# Altium schematic sheet discharge-tsmp.SchDoc: discharge-tsmp-board
size A4; Date: 05.10.2017; CheckedBy: UNCHECKED; Author: Leon Loeser; Organization: Baltic Racing; Address1: Zur Schwedenschanze 15; Address2: Haus 18; Address3: 18435 Stralsund; Revision: 1.0; SheetNumber: 1; SheetTotal: 1; Rules: EV 4.9, EV 4.7.6; ProjectName: Projekt
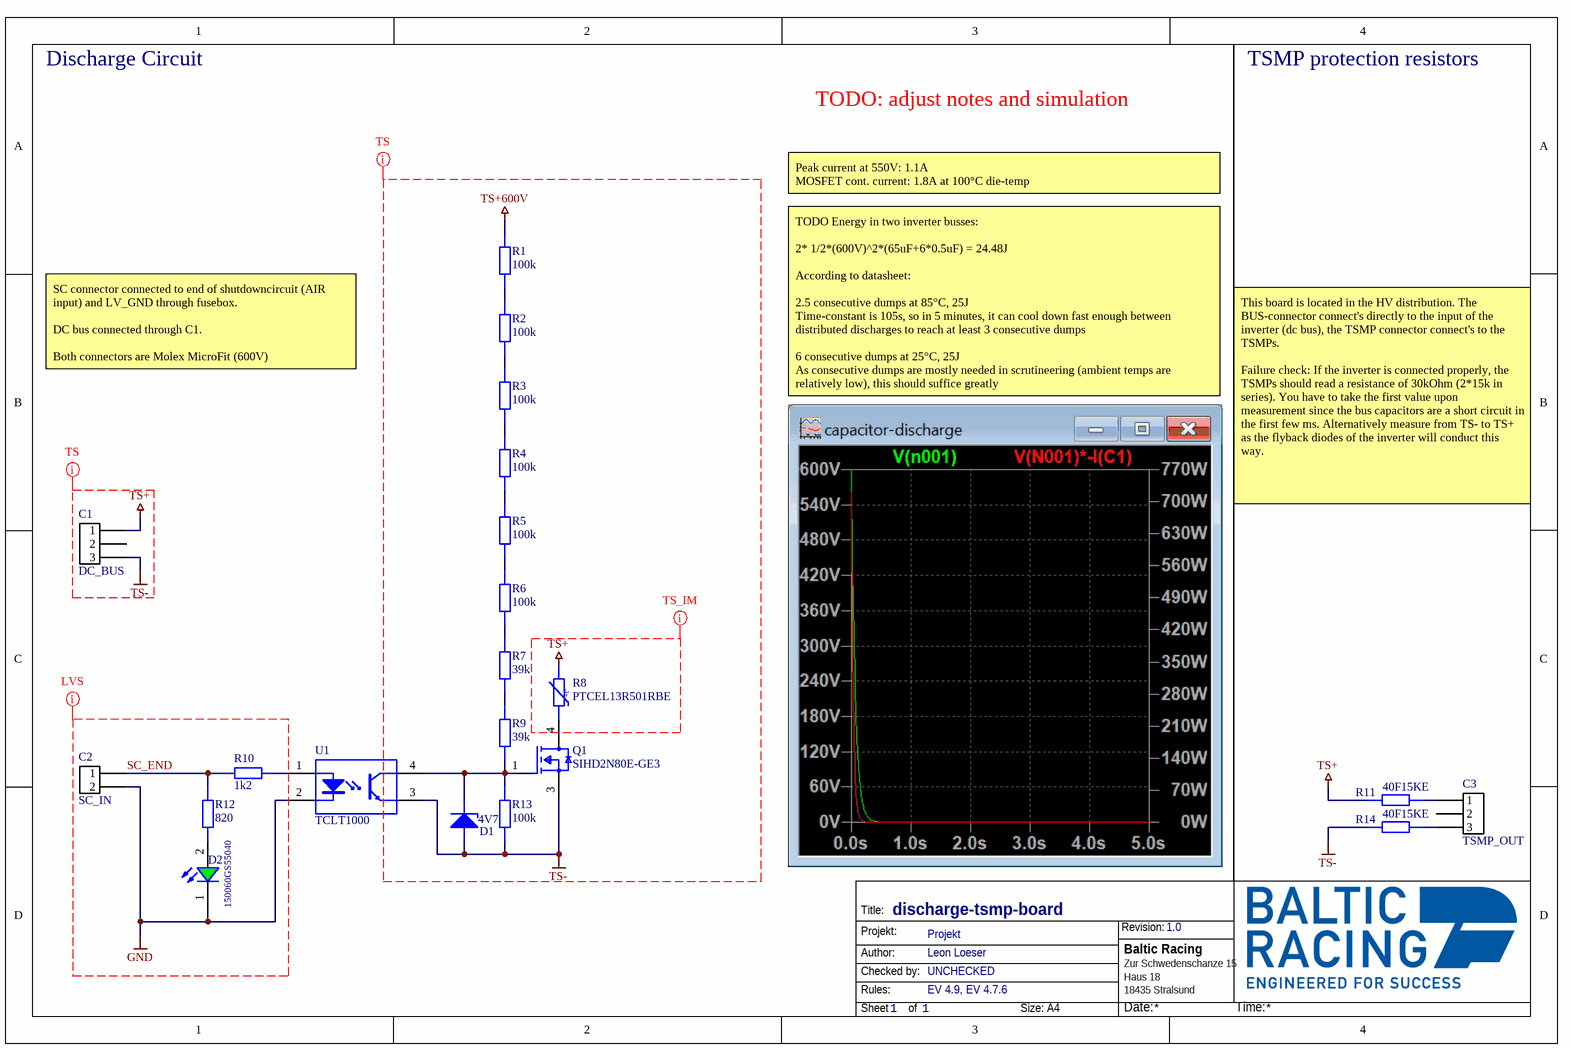
[diagram p0: discharge-tsmp.SchDoc]

## Parts
C1  DC_BUS  [43650-0309]
C2  SC_IN  [43650-0200]
C3  TSMP_OUT  [43650-0309]
D1  4V7  [SOT23]
D2  150060GS55040  [WL-SMCW_0603_H=0.7]
Q1  SIHD2N80E-GE3  [FP-T16-0236-MFG]
R1  value 100k  [STACKPOLE CSR1206]  (hidden comment: SMD Resistor)
R2  value 100k  [STACKPOLE CSR1206]  (hidden comment: SMD Resistor)
R3  value 100k  [STACKPOLE CSR1206]  (hidden comment: SMD Resistor)
R4  value 100k  [STACKPOLE CSR1206]  (hidden comment: SMD Resistor)
R5  value 100k  [STACKPOLE CSR1206]  (hidden comment: SMD Resistor)
R6  value 100k  [STACKPOLE CSR1206]  (hidden comment: SMD Resistor)
R7  value 39k  [STACKPOLE CSR1206]  (hidden comment: SMD Resistor)
R8  PTCEL13R501RBE  [PTCEL13_H]
R9  value 39k  [STACKPOLE CSR1206]  (hidden comment: SMD Resistor)
R10  value 1k2  [STACKPOLE CSR0603]  (hidden comment: SMD Resistor)
R11  40F15KE  [OHMITE_40_SERIES]
R12  value 820  [STACKPOLE CSR0603]  (hidden comment: SMD Resistor)
R13  value 100k  [STACKPOLE CSR0603]  (hidden comment: SMD Resistor)
R14  40F15KE  [OHMITE_40_SERIES]
U1  TCLT1000  [VISH-SOP4L-4_V]

## Nets
GND: C2.2 D2.1(K) U1.2(C)
TS+: C1.1 R8.1 R11.1
TS+600V: R1.2
TS-: C1.3 D1.A Q1.3(S) R13.1 R14.1 U1.3(E)
SC_END: C2.1 R10.2 R12.2
NetC3_1: C3.1 R11.2
NetC3_3: C3.3 R14.2
NetD1_C: D1.C Q1.1(G) R9.1 R13.2 U1.4(C)
NetD2_2: D2.2(A) R12.1
NetQ1_4: Q1.4(D) R8.2
NetR1_1: R1.1 R2.2
NetR2_1: R2.1 R3.2
NetR3_1: R3.1 R4.2
NetR4_1: R4.1 R5.2
NetR5_1: R5.1 R6.2
NetR6_1: R6.1 R7.2
NetR7_1: R7.1 R9.2
NetR10_1: R10.1 U1.1(A)

Not connected (* = marked no-connect by the designer): C1 2; C3 2

## Layout directives
net class TS: TS+, TS+600V, TS-
net class GLVS: GND, SC_END
net class TS_IM: TS+

## Notes on the sheet
- Discharge Circuit
- TSMP protection resistors
- TODO: adjust notes and simulation
- Peak current at 550V: 1.1A
  MOSFET cont. current: 1.8A at 100°C die-temp
  MOSFET pulsed current: 5A
- SC connector connected to end of shutdowncircuit (AIR input) and LV_GND through fusebox.
  DC bus connected through C1.
  Both connectors are Molex MicroFit (600V)
- TODO Energy in two inverter busses:
  2* 1/2*(600V)^2*(65uF+6*0.5uF) = 24.48J
  According to datasheet:
  2.5 consecutive dumps at 85°C, 25J
  Time-constant is 105s, so in 5 minutes, it can cool down fast enough between distributed discharges to reach at least 3 consecutive dumps
  6 consecutive dumps at 25°C, 25J
  As consecutive dumps are mostly needed in scrutineering (ambient temps are relatively low), this should suffice greatly
- This board is located in the HV distribution. The BUS-connector connect's directly to the input of the inverter (dc bus), the TSMP connector connect's to the TSMPs.
  Failure check: If the inverter is connected properly, the TSMPs should read a resistance of 30kOhm (2*15k in series). You have to take the first value upon measurement since the bus capacitors are a short circuit in the first few ms. Alternatively measure from TS- to TS+ as the flyback diodes of the inverter will conduct this way.
- Title:
- Projekt:
- Revision:
- Author:
- Rules:
- Checked by:
- Sheet
- of
- Size:
- A4
- Date:
- Time:
- (in symbol PTCEL13R501RBE) +t°

## Library data of the parts
C1 C3 = MicroFit3.0 3-Pin: Molex Micro-Fit 3.0 3-Pin / 600V / 8.5A
C2 = MicroFit3.0 2-Pin: Molex Micro-Fit 3.0 2-Pin / 600V / 8.5A
D1 = SMD Zener Diode: pin to pad: A>1 C>3
D2 = 150060GS75000: SMT Mono-color Chip LED Waterclear WL-SMCW, size 0603, Green, 3.2 V, 140 deg, 430 mcd; Forward Voltage: 3.2 V; Viewing Angle: 140 deg; Peak Wavelength: 515 nm; Dominant Wavelength: 525 nm; Luminous Intensity: 430 mcd; Chip Technology: InGaN; ComponentLink1Description: Manufacturer; ComponentLink1URL: http://www.we-online.de; ComponentLink2Description: Datasheet; ComponentLink2URL: https://katalog.we-online.de/led/datasheet/150060GS75000.pdf; Part Number: 150060GS75000; Published Date: November 2018; Publisher: Wurth Elektronik; Size: 0603; Operating Temperature: -40 to 85 degC; Emitting Color: Green; Mounting Technology: SMT; Packaging: Tape and Reel
Q1 = CMP-02550-000080-1: MOSFET N-CH 800V 2.8A DPAK; Manufacturer: Vishay; Description: N-Channel 800V 2.8A (Tc) 62.5W (Tc) Surface Mount D-PAK (TO-252AA); Drain To Source Resistance: 2.38Ω; Reverse Recovery Time: 278ns; Power Dissipation: 62.5W; Reverse Recovery Charge: 900nC; Input Capacitace At Vds: 315pF @ 100V; Number Of Channels: 1; Turn On Delay Time: 11ns; Threshold Vgs Max: 4V; Threshold Vgs Min: 2V; Rthja Max: 62°C/W; Turn Off Delay Time: 19ns; Transconductance: 1S; Depletion Mode: False; Gate Charge At Vgs: 9.8nC @ 10V; Max Forward Diode Voltage: 1.2V; Gate To Source Voltage: 30V; Max Junction Temp: +150°C; Pulse Drain Current: 5A; Drain To Source Voltage: 800V; Lead Free: Yes; Continuous Drain Current: 2.8A; Category: Trans; Temperature Range Low: -55°C; Octopart: https://octopart.com/sihd2n80e-ge3-vishay-84840963; Device Class L3: MOSFETs; Manufacturer Part Number: SIHD2N80E-GE3; Footprint Url: https://www.vishay.com/docs/72594/72594.pdf; ComponentLink2URL: https://www.vishay.com/docs/91987/sihd2n80e.pdf; Device Class L1: Discrete Semiconductors; ComponentLink2Description: Datasheet; Digikey Description: MOSFET N-CH 800V 2.8A DPAK; Temperature: -55°C to +150°C; Device Class L2: Transistors; Number Of N Channels: 1; Height: 2.507mm; Drain To Source Breakdown Voltage: 800V; Automotive: No; RoHS: TRUE; Temperature Range High: +150°C; Package: T16-0236
R1-R7 R9 R10 R12 R13 = SMD Resistor: Resistor with multiple footprints
R8 = PTCEL13R501RBE: PTC Thermistors, Inrush Current Limiter and Energy Load-Dump / 500Ohm, 150J; Manufacturer: Vishay; Supplier 1: Digi-Key; Manufacturer Part Number: PTCEL13R501RBE; RoHS: No; Stock 1: 1570; Pricing 1: 1=3,50000, 5=3,24600, 10=2,69700, 25=2,24760, 50=1,99800, 100=1,89810, 500=1,59840, 1000=1,49850, 5000=1,39860 (USD); Packaging: Bulk; ComponentLink1URL: http://www.vishay.com/docs/29165/ptcel.pdf?src-supplier=Digi-Key; ComponentLink1Description: http://www.vishay.com/docs/29165/ptcel.pdf?src-supplier=Digi-Key; Supplier Part Number 1: BC3320-ND
R11 R14 = 40F15KE: Wirewound Resistors 10watt 15K 1% Axial; Manufacturer: Ohmite; Power Rating: 10W; Temperature Coefficient: 20ppm/°C; Supplier 1: Mouser; Manufacturer Part Number: 40F15KE; RoHS: Yes; Category: Through-Hole Resistors; Stock 1: 619; Pricing 1: 1=2,89000, 10=2,61000, 50=2,14000, 100=2,06000, 1000=1,35000, 10000=1,32000 (USD); Mount: Through Hole; Case/Package: Axial; Tolerance: 1%; Resistance: 15k; Packaging: Bulk; Package Quantity: 25; Resistor Type: Wirewound; Number of Terminations: 2; Termination: Axial; Max Power Dissipation: 10W; Series: Ohmicone® 40; Length: 1.902inch; RoHS Compliant: Yes; Supplier Part Number 1: 588-40F15KE; ComponentLink4Description: Datasheet; ComponentLink4URL: https://www.ohmite.com/assets/docs/res_40.pdf; ComponentLink5Description: Product Page; ComponentLink5URL: https://www.ohmite.com/40-series
U1 = CMP-2000-07234-1: Optocoupler, Phototransistor Output, VCEO 70 V, -55 to 100 degC, 4-Pin SOP (SOP4L), RoHS, Tape and Reel; Manufacturer: Vishay/Semiconductor; Maximum Collector Emitter Voltage: 70V; Input Type: DC; Maximum Reverse Voltage: 6V; Maximum Collector Emitter Saturation Voltage: 300mV; Number of Channels per Chip: 1; Maximum Collector Current: 50mA; Maximum Power Dissipation: 250mW; Maximum Forward Voltage: 1.6V; Maximum Input Current: 60mA; Typical Forward Voltage: 1.25V; Minimum Isolation Voltage: 5000Vrms; Maximum Current Transfer Ratio @ Current: 600%; Manufacturer URL: http://www.vishay.com/; Package: 4SOP; Mounting Technology: SurfaceMount; Category: TransistorandPhotovoltaicOutputPhotoCouplers; Datasheet URL: http://www.vishay.com/docs/83515/tclt1000.pdf; Output Type: DC; Operating Temperature: -40to100°C; Package Description: 4-Pin Small Outline Package Integrated Circuit, Body 4.1 x 7.5 mm, Pitch 2.54 mm; Datasheet Version: Rev. 2.9, 12/2015; Package Reference: SOP4L; Packaging: Tape&Reel